# Altium schematic sheet DcDc3V3.SchDoc
size 420 x 297 mm; DocumentNumber: DcDc3V3
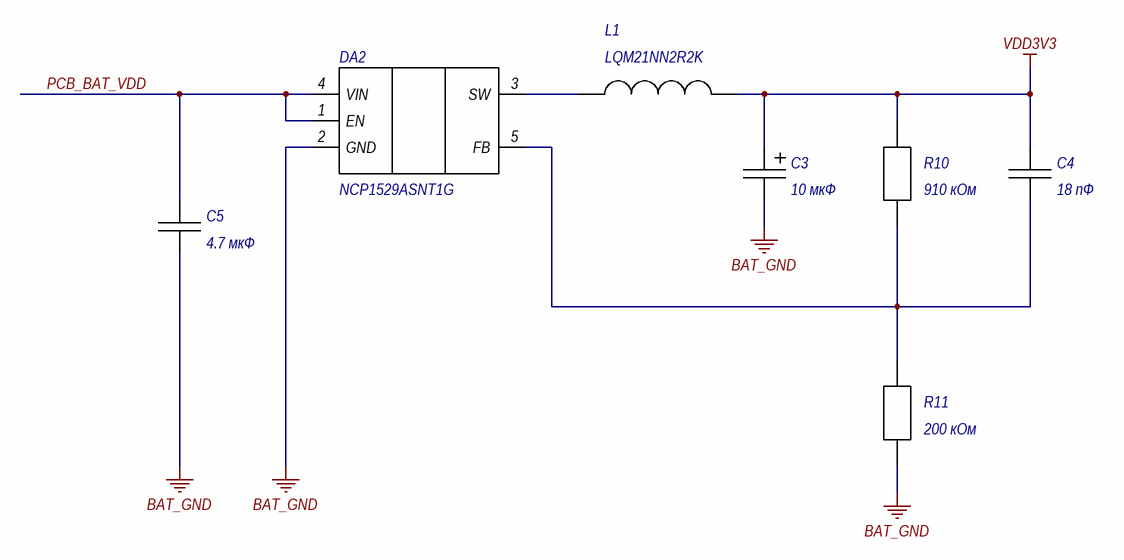
[diagram p0: DcDc3V3.SchDoc]

## Parts
C3  10 мкФ  [C TAN_A]
C4  18 пФ  [C 0805]
C5  4.7 мкФ  [C 0805]
DA2  NCP1529ASNT1G  [TSOP-5]
L1  LQM21NN2R2K  [LQM21N]
R10  910 кОм  [RES 0402]
R11  200 кОм  [RES 0402]

## Nets
BAT_GND: C3.2 C5.2 DA2.2(GND) R11.2
VDD3V3: C3.1 C4.1 L1.2 R10.2
PCB_BAT_VDD: C5.1 DA2.1(EN) DA2.4(VIN)
NetC4_2: C4.2 DA2.5(FB) R10.1 R11.1
NetDA2_3: DA2.3(SW) L1.1

## Notes on the sheet
- Подп. и дата
- Инв. № дубл.
- Взам. инв. №
- Инв. № подл.
- Лист
- Изм.
- № докум.
- Подп.
- Дата
- Копировал
- Формат А3

## Library data of the parts
C3 = CAP TAN_A: SMD Tantalium Capacitor A; Type: Конденсатор танталовый; Rated voltage: 16; Size: A
C4 C5 = CAP 0805: SMD Capacitor 0805; Manufacturer: /Укажите компанию-производителя/; Tolerance: /Укажите допуск в процентах/; Temperature coefficient: /Формат: ±? ppm/°C/; Type: Конденсатор керамический; TC: /Укажите тип диэлектрика/; Size: 0805; Temperature range: /Формат: -? ... ? °C/
R10 R11 = RES 0402